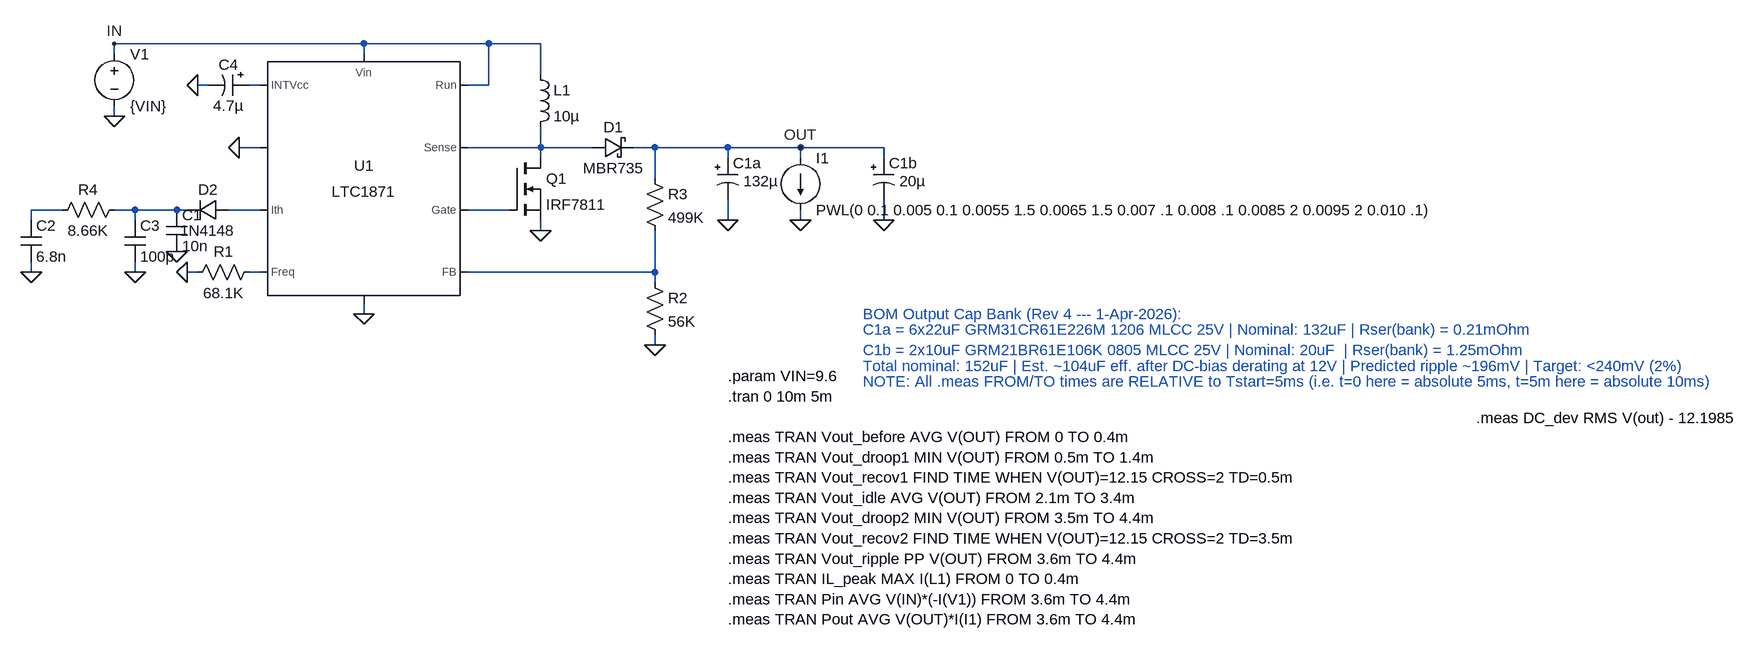
[diagram p0: schematic LTC1871_BOM_Caps_Rev4.asc]
LTC1871_BOM_Caps_Rev4.asc, the LTspice schematic file:
Version 4.1
SHEET 1 5664 2264
WIRE 1632 1168 1248 1168
WIRE 1824 1168 1632 1168
WIRE 1904 1168 1824 1168
WIRE 1248 1184 1248 1168
WIRE 1632 1184 1632 1168
WIRE 1904 1216 1904 1168
WIRE 1392 1232 1376 1232
WIRE 1472 1232 1456 1232
WIRE 1824 1232 1824 1168
WIRE 1824 1232 1792 1232
WIRE 1248 1280 1248 1264
WIRE 1472 1328 1440 1328
WIRE 1904 1328 1904 1296
WIRE 1904 1328 1792 1328
WIRE 1984 1328 1904 1328
WIRE 2080 1328 2048 1328
WIRE 2192 1328 2080 1328
WIRE 2304 1328 2192 1328
WIRE 2432 1328 2304 1328
WIRE 1904 1344 1904 1328
WIRE 2192 1344 2192 1328
WIRE 2304 1344 2304 1328
WIRE 2432 1344 2432 1328
WIRE 2080 1376 2080 1328
WIRE 1168 1424 1120 1424
WIRE 1280 1424 1248 1424
WIRE 1344 1424 1280 1424
WIRE 1360 1424 1344 1424
WIRE 1472 1424 1424 1424
WIRE 1856 1424 1792 1424
WIRE 1120 1440 1120 1424
WIRE 1280 1440 1280 1424
WIRE 2192 1440 2192 1408
WIRE 2304 1440 2304 1424
WIRE 2432 1440 2432 1408
WIRE 1904 1456 1904 1440
WIRE 1120 1520 1120 1504
WIRE 1280 1520 1280 1504
WIRE 1376 1520 1360 1520
WIRE 1472 1520 1456 1520
WIRE 2080 1520 2080 1456
WIRE 2080 1520 1792 1520
WIRE 2080 1536 2080 1520
WIRE 1632 1584 1632 1568
WIRE 2080 1632 2080 1616
FLAG 1904 1456 0
FLAG 1360 1520 0
FLAG 2080 1632 0
FLAG 1632 1584 0
FLAG 2192 1440 0
FLAG 1280 1520 0
FLAG 1120 1520 0
FLAG 2304 1440 0
FLAG 2432 1440 0
FLAG 1248 1280 0
FLAG 1440 1328 0
FLAG 1376 1232 0
FLAG 2304 1328 OUT
FLAG 1248 1168 IN
FLAG 1344 1488 0
SYMBOL NMOS 1856 1344 R0
SYMATTR InstName Q1
SYMATTR Value IRF7811
SYMBOL RES 1472 1504 R90
WINDOW 0 0 56 VBottom 2
WINDOW 3 32 56 VTop 2
SYMATTR InstName R1
SYMATTR Value 68.1K
SYMBOL res 2064 1520 R0
SYMATTR InstName R2
SYMATTR Value 56K
SYMBOL res 2064 1360 R0
SYMATTR InstName R3
SYMATTR Value 499K
SYMBOL ind 1888 1200 R0
SYMATTR InstName L1
SYMATTR Value 10µ
SYMBOL schottky 1984 1344 R270
WINDOW 0 32 32 VTop 2
WINDOW 3 0 32 VBottom 2
SYMATTR InstName D1
SYMATTR Value MBR735
SYMBOL polcap 2176 1344 R0
WINDOW 40 27 64 Left 2
WINDOW 3 40 36 Left 2
SYMATTR Value 132µ
SYMATTR InstName C1a
SYMATTR SpiceLine Rser=0.00021
SYMBOL polcap 2416 1344 R0
WINDOW 40 27 64 Left 2
WINDOW 3 40 36 Left 2
SYMATTR Value 20µ
SYMATTR InstName C1b
SYMATTR SpiceLine Rser=0.00125
SYMBOL res 1264 1408 R90
WINDOW 0 0 56 VBottom 2
WINDOW 3 32 56 VTop 2
SYMATTR InstName R4
SYMATTR Value 8.66K
SYMBOL cap 1104 1440 R0
SYMATTR InstName C2
SYMATTR Value 6.8n
SYMBOL cap 1264 1440 R0
SYMATTR InstName C3
SYMATTR Value 100p
SYMBOL POWERPRODUCTS\\LTC1871 1632 1376 R0
SYMATTR InstName U1
SYMBOL VOLTAGE 1248 1168 R0
WINDOW 123 0 0 Left 0
WINDOW 39 0 0 Left 0
SYMATTR InstName V1
SYMATTR Value {VIN}
SYMBOL polcap 1456 1216 R90
WINDOW 0 0 32 VBottom 2
WINDOW 3 32 32 VTop 2
SYMATTR InstName C4
SYMATTR Value 4.7µ
SYMBOL current 2304 1344 R0
WINDOW 123 0 0 Left 0
WINDOW 39 0 0 Left 0
SYMATTR InstName I1
SYMATTR Value PWL(0 0.1 0.005 0.1 0.0055 1.5 0.0065 1.5 0.007 .1 0.008 .1 0.0085 2 0.0095 2 0.010 .1)
SYMBOL diode 1424 1408 R90
WINDOW 0 0 32 VBottom 2
WINDOW 3 32 32 VTop 2
SYMATTR InstName D2
SYMATTR Value 1N4148
SYMBOL cap 1328 1424 R0
SYMATTR InstName C1
SYMATTR Value 10n
TEXT 2192 1680 Left 2 !.param VIN=9.6\n.tran 0 10m 5m\n \n.meas TRAN Vout_before AVG V(OUT) FROM 0 TO 0.4m\n.meas TRAN Vout_droop1 MIN V(OUT) FROM 0.5m TO 1.4m\n.meas TRAN Vout_recov1 FIND TIME WHEN V(OUT)=12.15 CROSS=2 TD=0.5m\n.meas TRAN Vout_idle AVG V(OUT) FROM 2.1m TO 3.4m\n.meas TRAN Vout_droop2 MIN V(OUT) FROM 3.5m TO 4.4m\n.meas TRAN Vout_recov2 FIND TIME WHEN V(OUT)=12.15 CROSS=2 TD=3.5m\n.meas TRAN Vout_ripple PP V(OUT) FROM 3.6m TO 4.4m\n.meas TRAN IL_peak MAX I(L1) FROM 0 TO 0.4m\n.meas TRAN Pin AVG V(IN)*(-I(V1)) FROM 3.6m TO 4.4m\n.meas TRAN Pout AVG V(OUT)*I(I1) FROM 3.6m TO 4.4m
TEXT 3344 1744 Left 2 !.meas DC_dev RMS V(out) - 12.1985
TEXT 2400 1584 Left 2 ;BOM Output Cap Bank (Rev 4 --- 1-Apr-2026):
TEXT 2400 1608 Left 2 ;C1a = 6x22uF GRM31CR61E226M 1206 MLCC 25V | Nominal: 132uF | Rser(bank) = 0.21mOhm
TEXT 2400 1640 Left 2 ;C1b = 2x10uF GRM21BR61E106K 0805 MLCC 25V | Nominal: 20uF  | Rser(bank) = 1.25mOhm
TEXT 2400 1664 Left 2 ;Total nominal: 152uF | Est. ~104uF eff. after DC-bias derating at 12V | Predicted ripple ~196mV | Target: <240mV (2%)
TEXT 2400 1688 Left 2 ;NOTE: All .meas FROM/TO times are RELATIVE to Tstart=5ms (i.e. t=0 here = absolute 5ms, t=5m here = absolute 10ms)

The netlist it stands for:
* LTC1871_BOM_Caps_Rev4.asc
M§Q1 N002 N006 0 0 IRF7811
R1 N007 0 68.1K
R2 N008 0 56K
R3 OUT N008 499K
L1 IN N002 10µ
D1 N002 OUT MBR735
C1a OUT 0 132µ Rser=0.00021
C1b OUT 0 20µ Rser=0.00125
R4 N004 N003 8.66K
C2 N003 0 6.8n
C3 N004 0 100p
X§U1 IN N005 N008 N007 0 0 N006 N001 IN N002 LTC1871  ; pins Run Ith FB Freq ? ? Gate INTVcc Vin Sense
V1 IN 0 {VIN}
C4 N001 0 4.7µ
I1 OUT 0 PWL(0 0.1 0.005 0.1 0.0055 1.5 0.0065 1.5 0.007 .1 0.008 .1 0.0085 2 0.0095 2 0.010 .1)
D2 N005 N004 1N4148
C1 N004 0 10n
.model D D
.lib standard.dio
.model NMOS NMOS
.model PMOS PMOS
.lib standard.mos
.param VIN=9.6
.tran 0 10m 5m
.meas TRAN Vout_before AVG V(OUT) FROM 0 TO 0.4m
.meas TRAN Vout_droop1 MIN V(OUT) FROM 0.5m TO 1.4m
.meas TRAN Vout_recov1 FIND TIME WHEN V(OUT)=12.15 CROSS=2 TD=0.5m
.meas TRAN Vout_idle AVG V(OUT) FROM 2.1m TO 3.4m
.meas TRAN Vout_droop2 MIN V(OUT) FROM 3.5m TO 4.4m
.meas TRAN Vout_recov2 FIND TIME WHEN V(OUT)=12.15 CROSS=2 TD=3.5m
.meas TRAN Vout_ripple PP V(OUT) FROM 3.6m TO 4.4m
.meas TRAN IL_peak MAX I(L1) FROM 0 TO 0.4m
.meas TRAN Pin AVG V(IN)*(-I(V1)) FROM 3.6m TO 4.4m
.meas TRAN Pout AVG V(OUT)*I(I1) FROM 3.6m TO 4.4m
.meas DC_dev RMS V(out) - 12.1985
* BOM Output Cap Bank (Rev 4 --- 1-Apr-2026):
* C1a = 6x22uF GRM31CR61E226M 1206 MLCC 25V | Nominal: 132uF | Rser(bank) = 0.21mOhm
* C1b = 2x10uF GRM21BR61E106K 0805 MLCC 25V | Nominal: 20uF  | Rser(bank) = 1.25mOhm
* Total nominal: 152uF | Est. ~104uF eff. after DC-bias derating at 12V | Predicted ripple ~196mV | Target: <240mV (2%)
* NOTE: All .meas FROM/TO times are RELATIVE to Tstart=5ms (i.e. t=0 here = absolute 5ms, t=5m here = absolute 10ms)
.lib LTC1871.sub
.backanno
.end